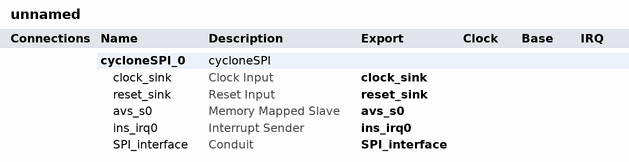
[diagram p0: system contents]
# Platform Designer (Qsys) system unnamed, Cyclone IV E EP4CE22F17C6
# Parameters at their usual value, and those the tool derives, are not listed.
package require qsys
create_system unnamed
set_project_property DEVICE_FAMILY {Cyclone IV E}
set_project_property DEVICE EP4CE22F17C6

add_instance cycloneSPI_0 cycloneSPI 1.0
set_instance_property cycloneSPI_0 AUTO_EXPORT true

# exported interfaces
add_interface SPI_interface conduit end
set_interface_property SPI_interface EXPORT_OF cycloneSPI_0.SPI_interface
add_interface avs_s0 avalon slave
set_interface_property avs_s0 EXPORT_OF cycloneSPI_0.avs_s0
add_interface clock_sink clock sink
set_interface_property clock_sink EXPORT_OF cycloneSPI_0.clock_sink
add_interface ins_irq0 interrupt sender
set_interface_property ins_irq0 EXPORT_OF cycloneSPI_0.ins_irq0
add_interface reset_sink reset sink
set_interface_property reset_sink EXPORT_OF cycloneSPI_0.reset_sink

set_interconnect_requirement {$system} qsys_mm.clockCrossingAdapter HANDSHAKE
set_interconnect_requirement {$system} qsys_mm.enableEccProtection FALSE
set_interconnect_requirement {$system} qsys_mm.insertDefaultSlave FALSE
set_interconnect_requirement {$system} qsys_mm.maxAdditionalLatency 1

save_system unnamed.qsys
